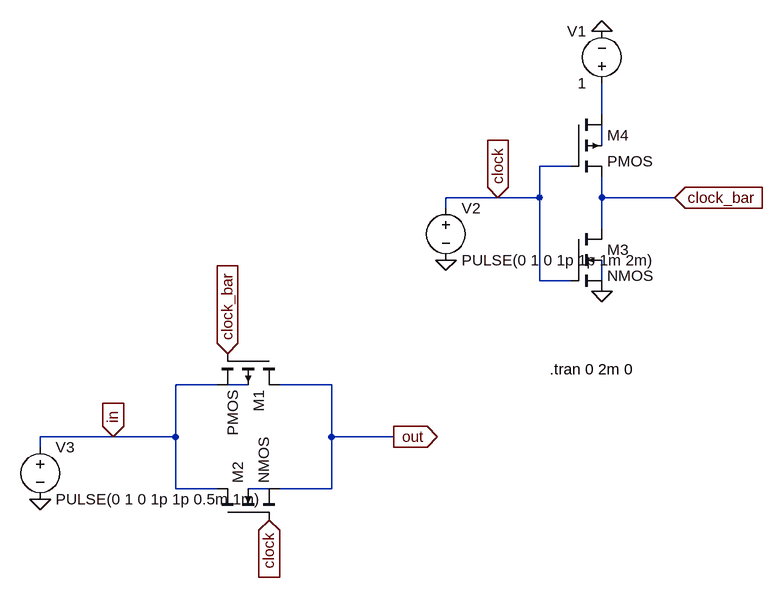
[diagram p0: schematic Transmission_gate vani.asc]
Transmission_gate vani.asc, the LTspice schematic file:
Version 4
SHEET 1 1052 680
WIRE 768 -272 768 -320
WIRE 768 -224 768 -256
WIRE 720 -192 672 -192
WIRE 608 -144 528 -144
WIRE 672 -144 672 -192
WIRE 672 -144 608 -144
WIRE 768 -144 768 -176
WIRE 880 -144 768 -144
WIRE 528 -128 528 -144
WIRE 768 -96 768 -144
WIRE 672 -16 672 -144
WIRE 720 -16 672 -16
WIRE 768 -16 768 -48
WIRE 176 144 112 144
WIRE 224 144 192 144
WIRE 352 144 272 144
WIRE 16 224 -96 224
WIRE 112 224 112 144
WIRE 112 224 16 224
WIRE 352 224 352 144
WIRE 448 224 352 224
WIRE -96 240 -96 224
WIRE 112 304 112 224
WIRE 176 304 112 304
WIRE 256 304 224 304
WIRE 352 304 352 224
WIRE 352 304 272 304
FLAG 768 0 0
FLAG 768 -400 0
FLAG 528 -48 0
FLAG 608 -144 clock
IOPIN 608 -144 In
FLAG 256 352 clock
IOPIN 256 352 In
FLAG 880 -144 clock_bar
IOPIN 880 -144 In
FLAG 192 96 clock_bar
IOPIN 192 96 In
FLAG -96 320 0
FLAG 448 224 out
IOPIN 448 224 Out
FLAG 16 224 in
IOPIN 16 224 In
SYMBOL pmos4 272 96 R90
SYMATTR InstName M1
SYMBOL nmos4 176 352 R270
SYMATTR InstName M2
SYMBOL nmos4 720 -96 R0
SYMATTR InstName M3
SYMATTR Value2 l=2u w=40u
SYMBOL pmos4 720 -272 R0
SYMATTR InstName M4
SYMATTR Value2 l=2u w=20u
SYMBOL voltage 768 -304 R180
WINDOW 0 24 96 Left 2
WINDOW 3 24 16 Left 2
WINDOW 123 0 0 Left 0
WINDOW 39 0 0 Left 0
SYMATTR InstName V1
SYMATTR Value 1
SYMBOL voltage 528 -144 R0
WINDOW 123 0 0 Left 0
WINDOW 39 0 0 Left 0
SYMATTR InstName V2
SYMATTR Value PULSE(0 1 0 1p 1p 1m 2m)
SYMBOL voltage -96 224 R0
WINDOW 123 0 0 Left 0
WINDOW 39 0 0 Left 0
SYMATTR InstName V3
SYMATTR Value PULSE(0 1 0 1p 1p 0.5m 1m)
TEXT 688 120 Left 2 !.tran 0 2m 0

The netlist it stands for:
* Transmission_gate vani.asc
M1 out clock_bar in N004 PMOS
M2 in clock out N005 NMOS
M3 clock_bar clock 0 N003 NMOS l=2u w=40u
M4 N001 clock clock_bar N002 PMOS l=2u w=20u
V1 N001 0 1
V2 clock 0 PULSE(0 1 0 1p 1p 1m 2m)
V3 in 0 PULSE(0 1 0 1p 1p 0.5m 1m)
.model NMOS NMOS
.model PMOS PMOS
.lib standard.mos
.tran 0 2m 0
.backanno
.end